# Altium schematic sheet FPGA_0.SchDoc
size A1; SheetNumber: 8; SheetTotal: 14
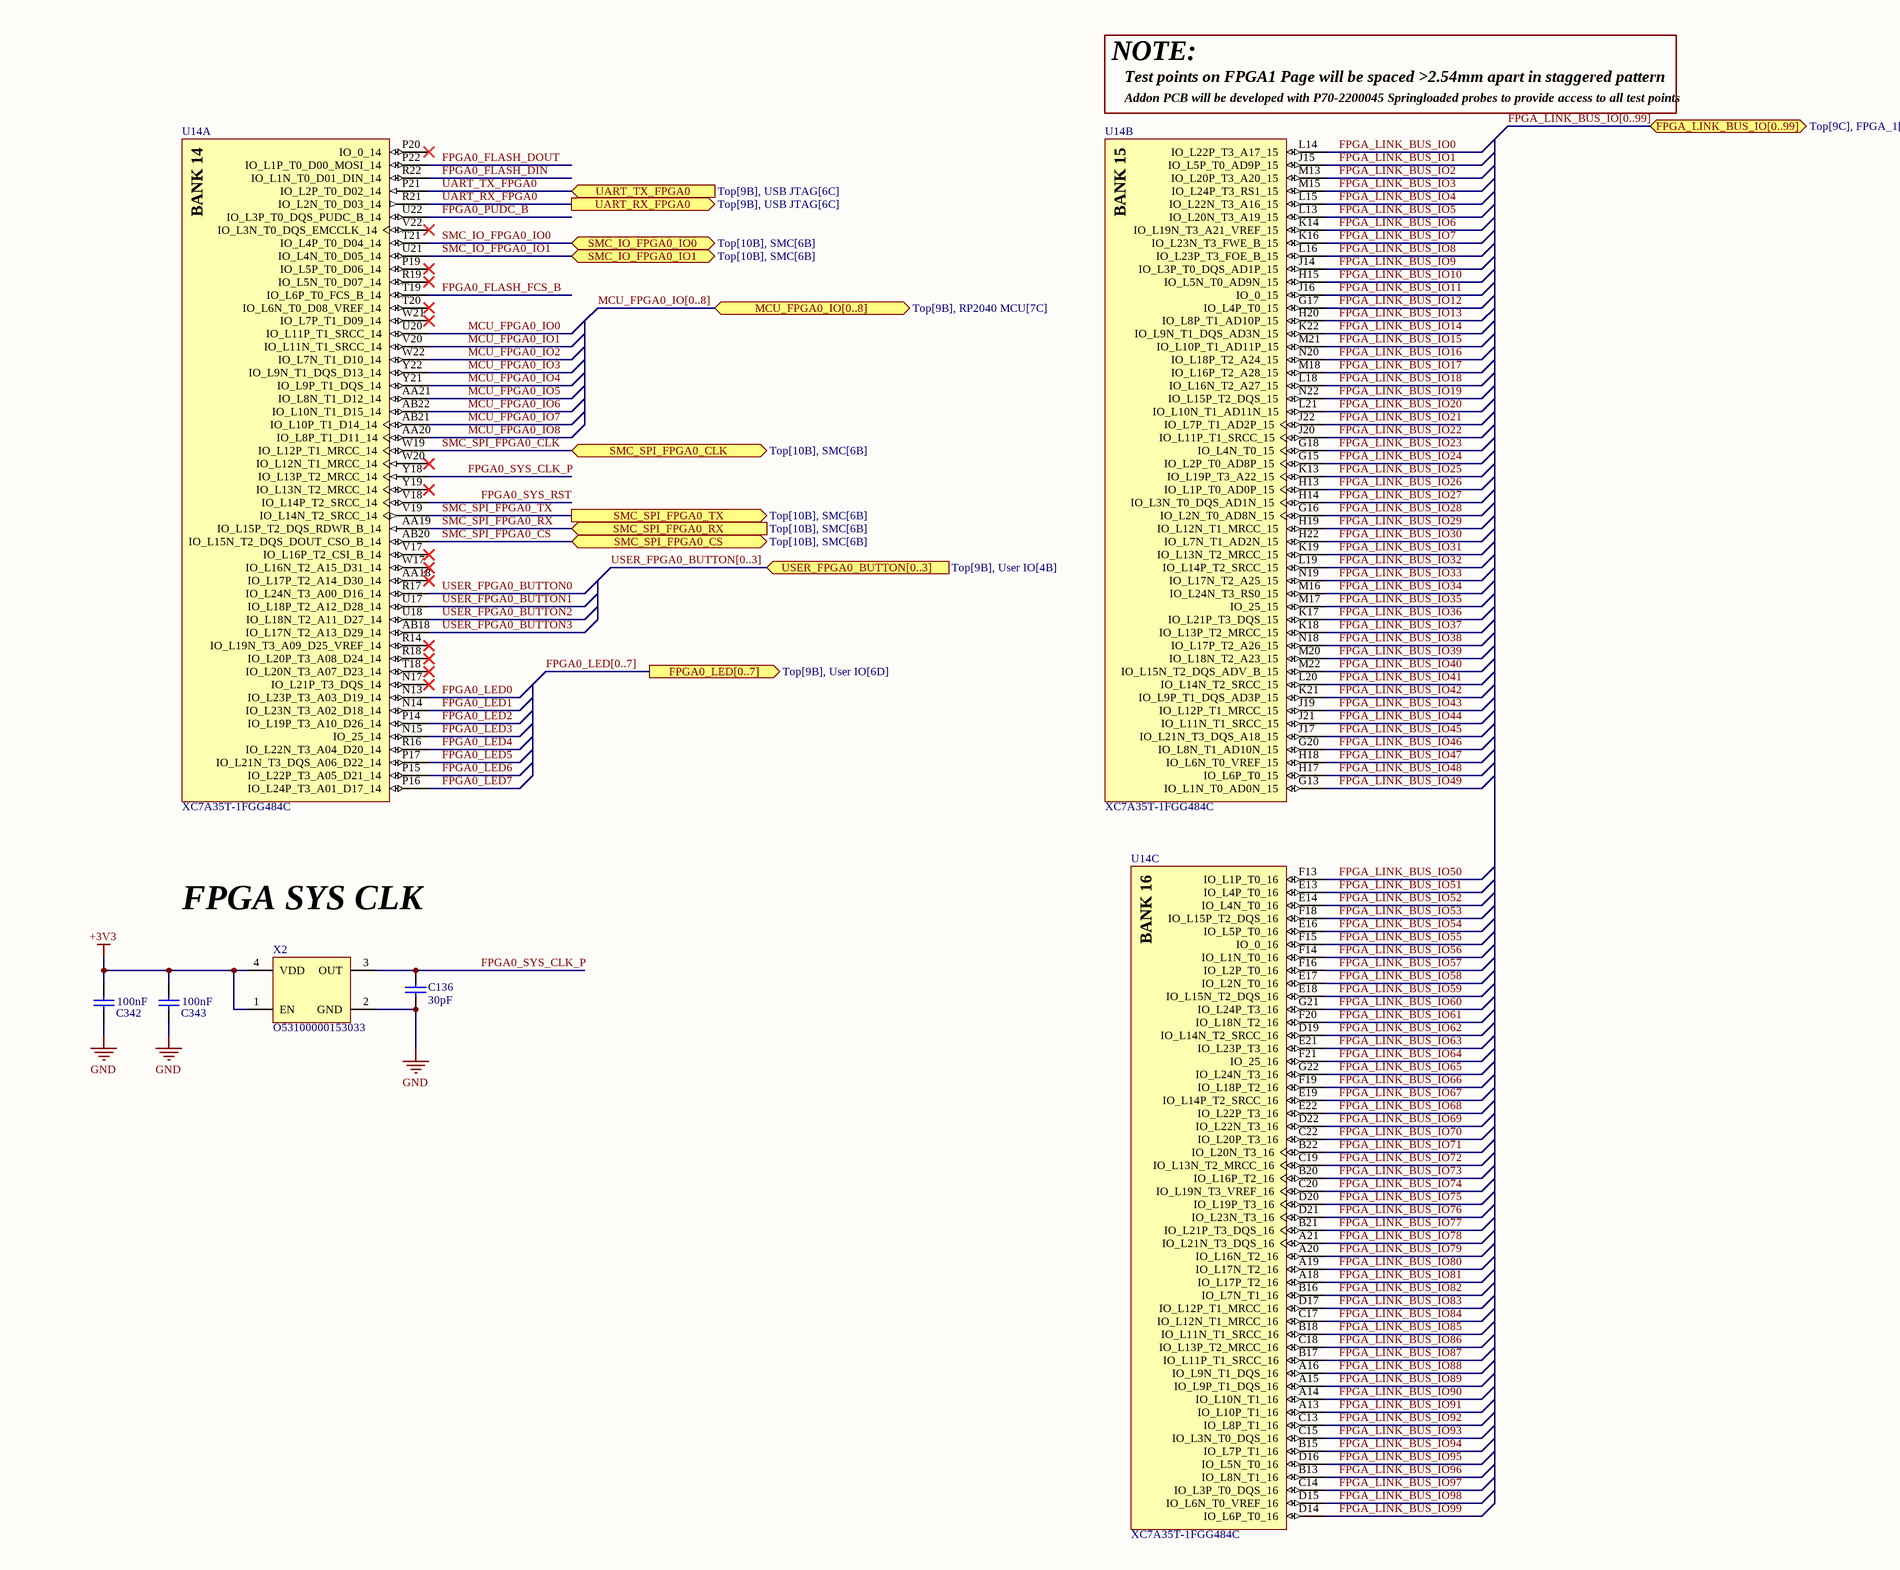
[diagram p0: FPGA_0.SchDoc, top left]
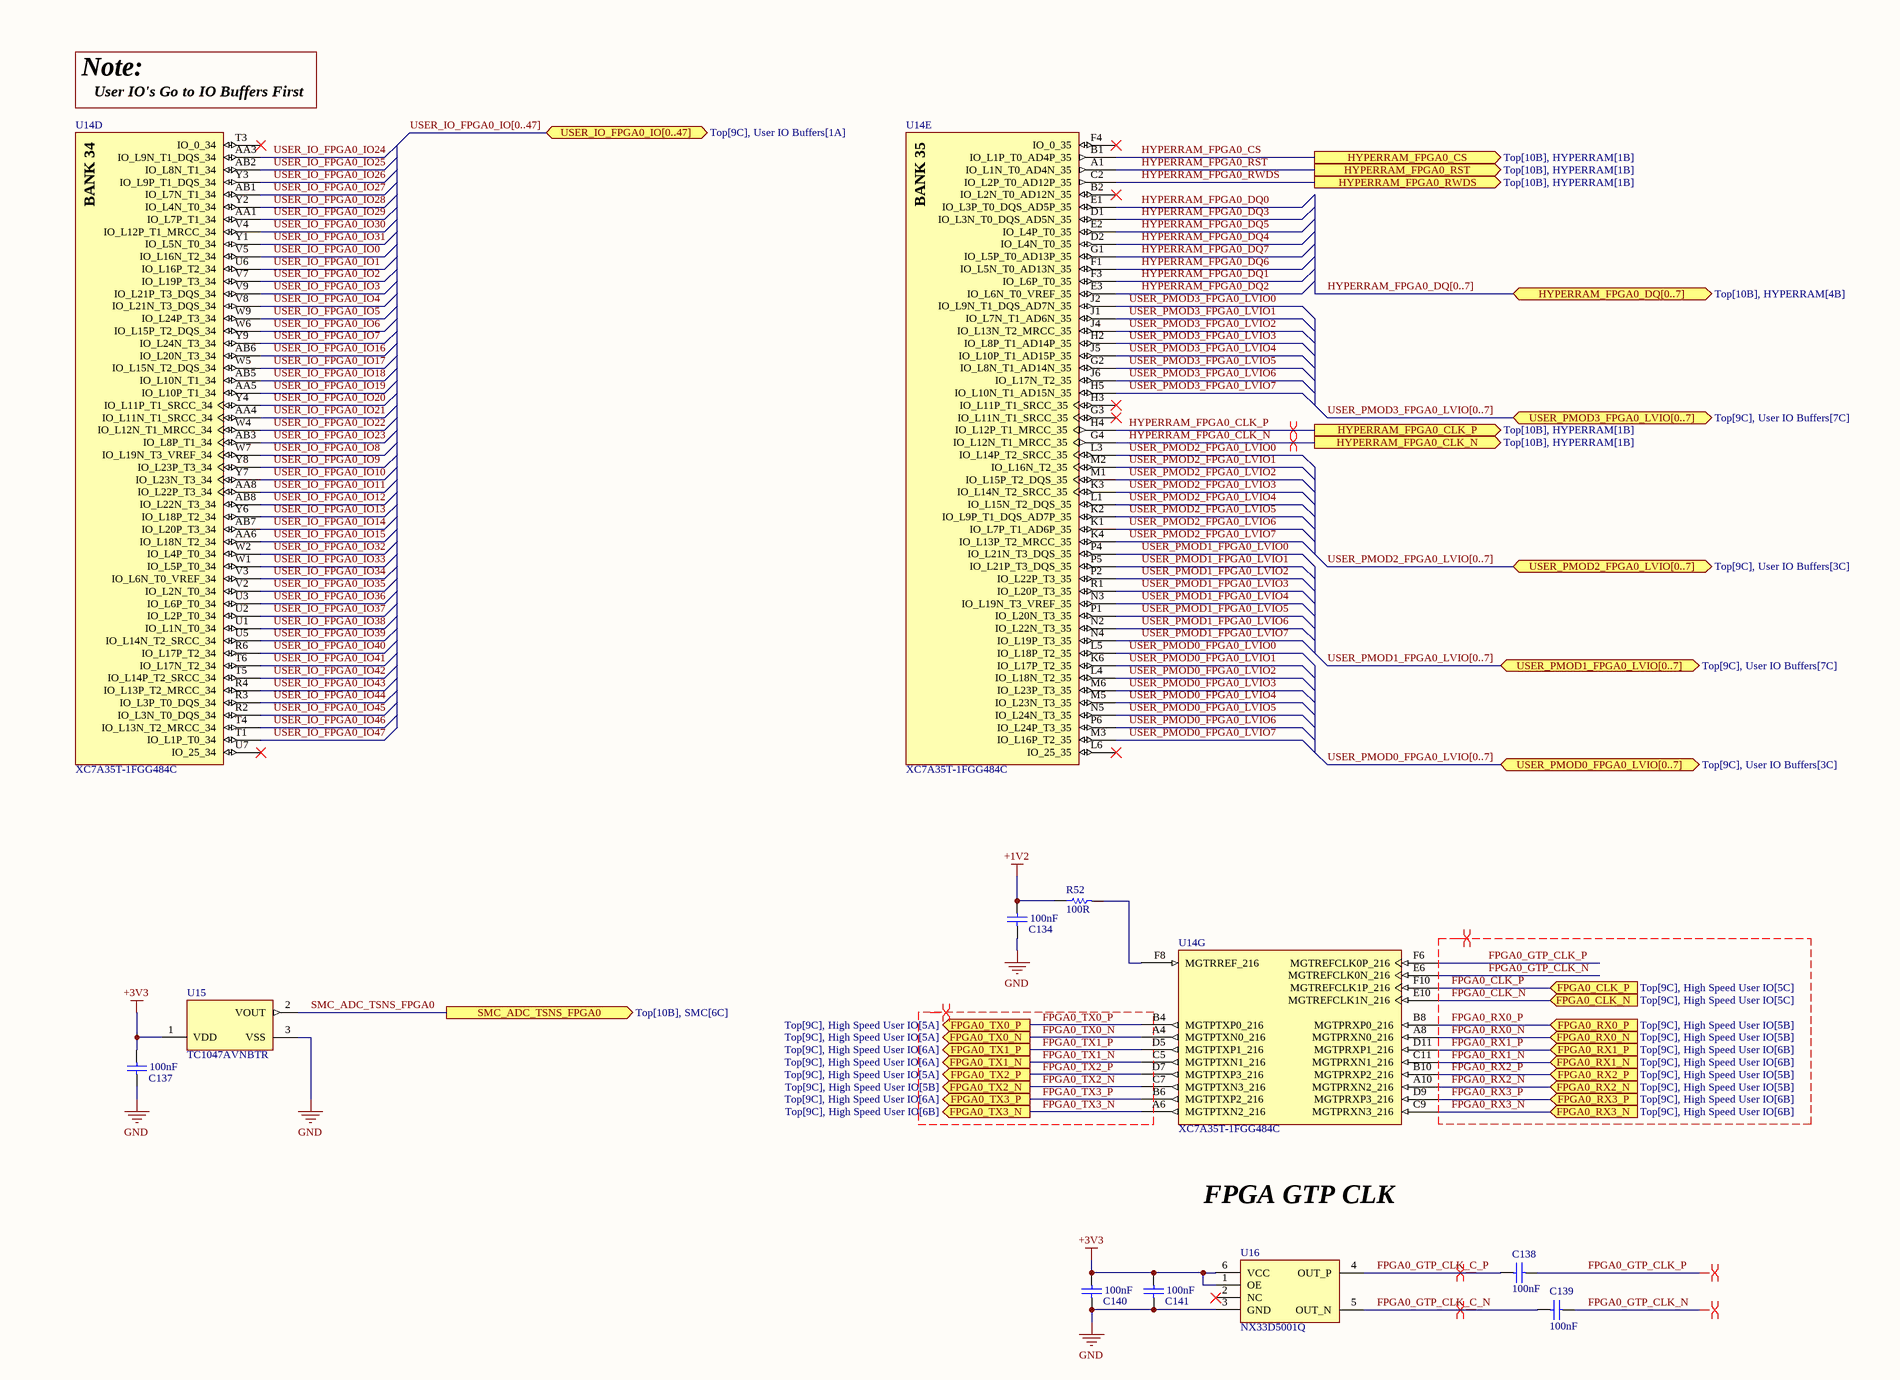
[diagram p1: FPGA_0.SchDoc, top right]
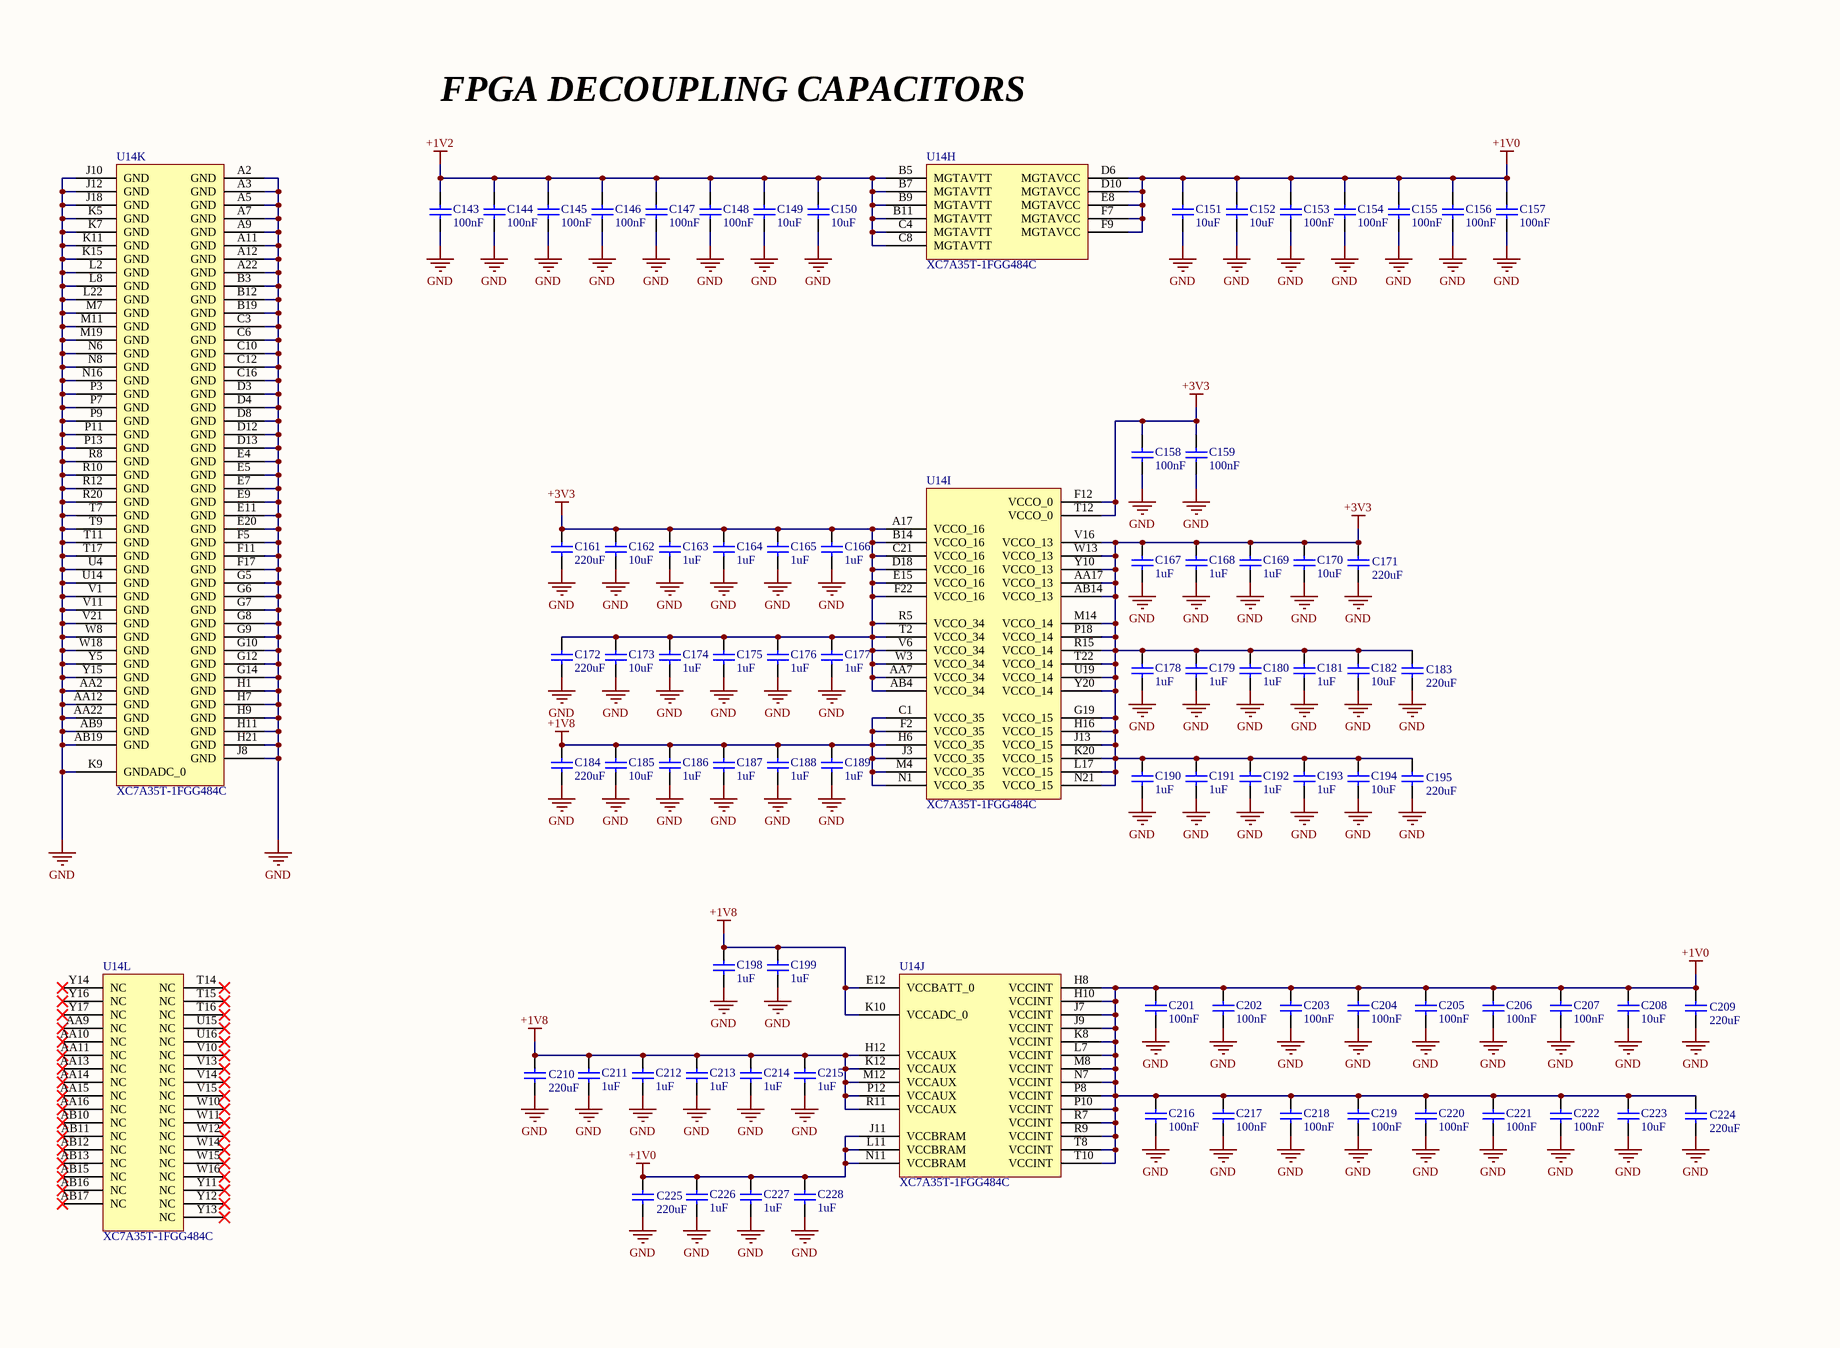
[diagram p2: FPGA_0.SchDoc, bottom left]
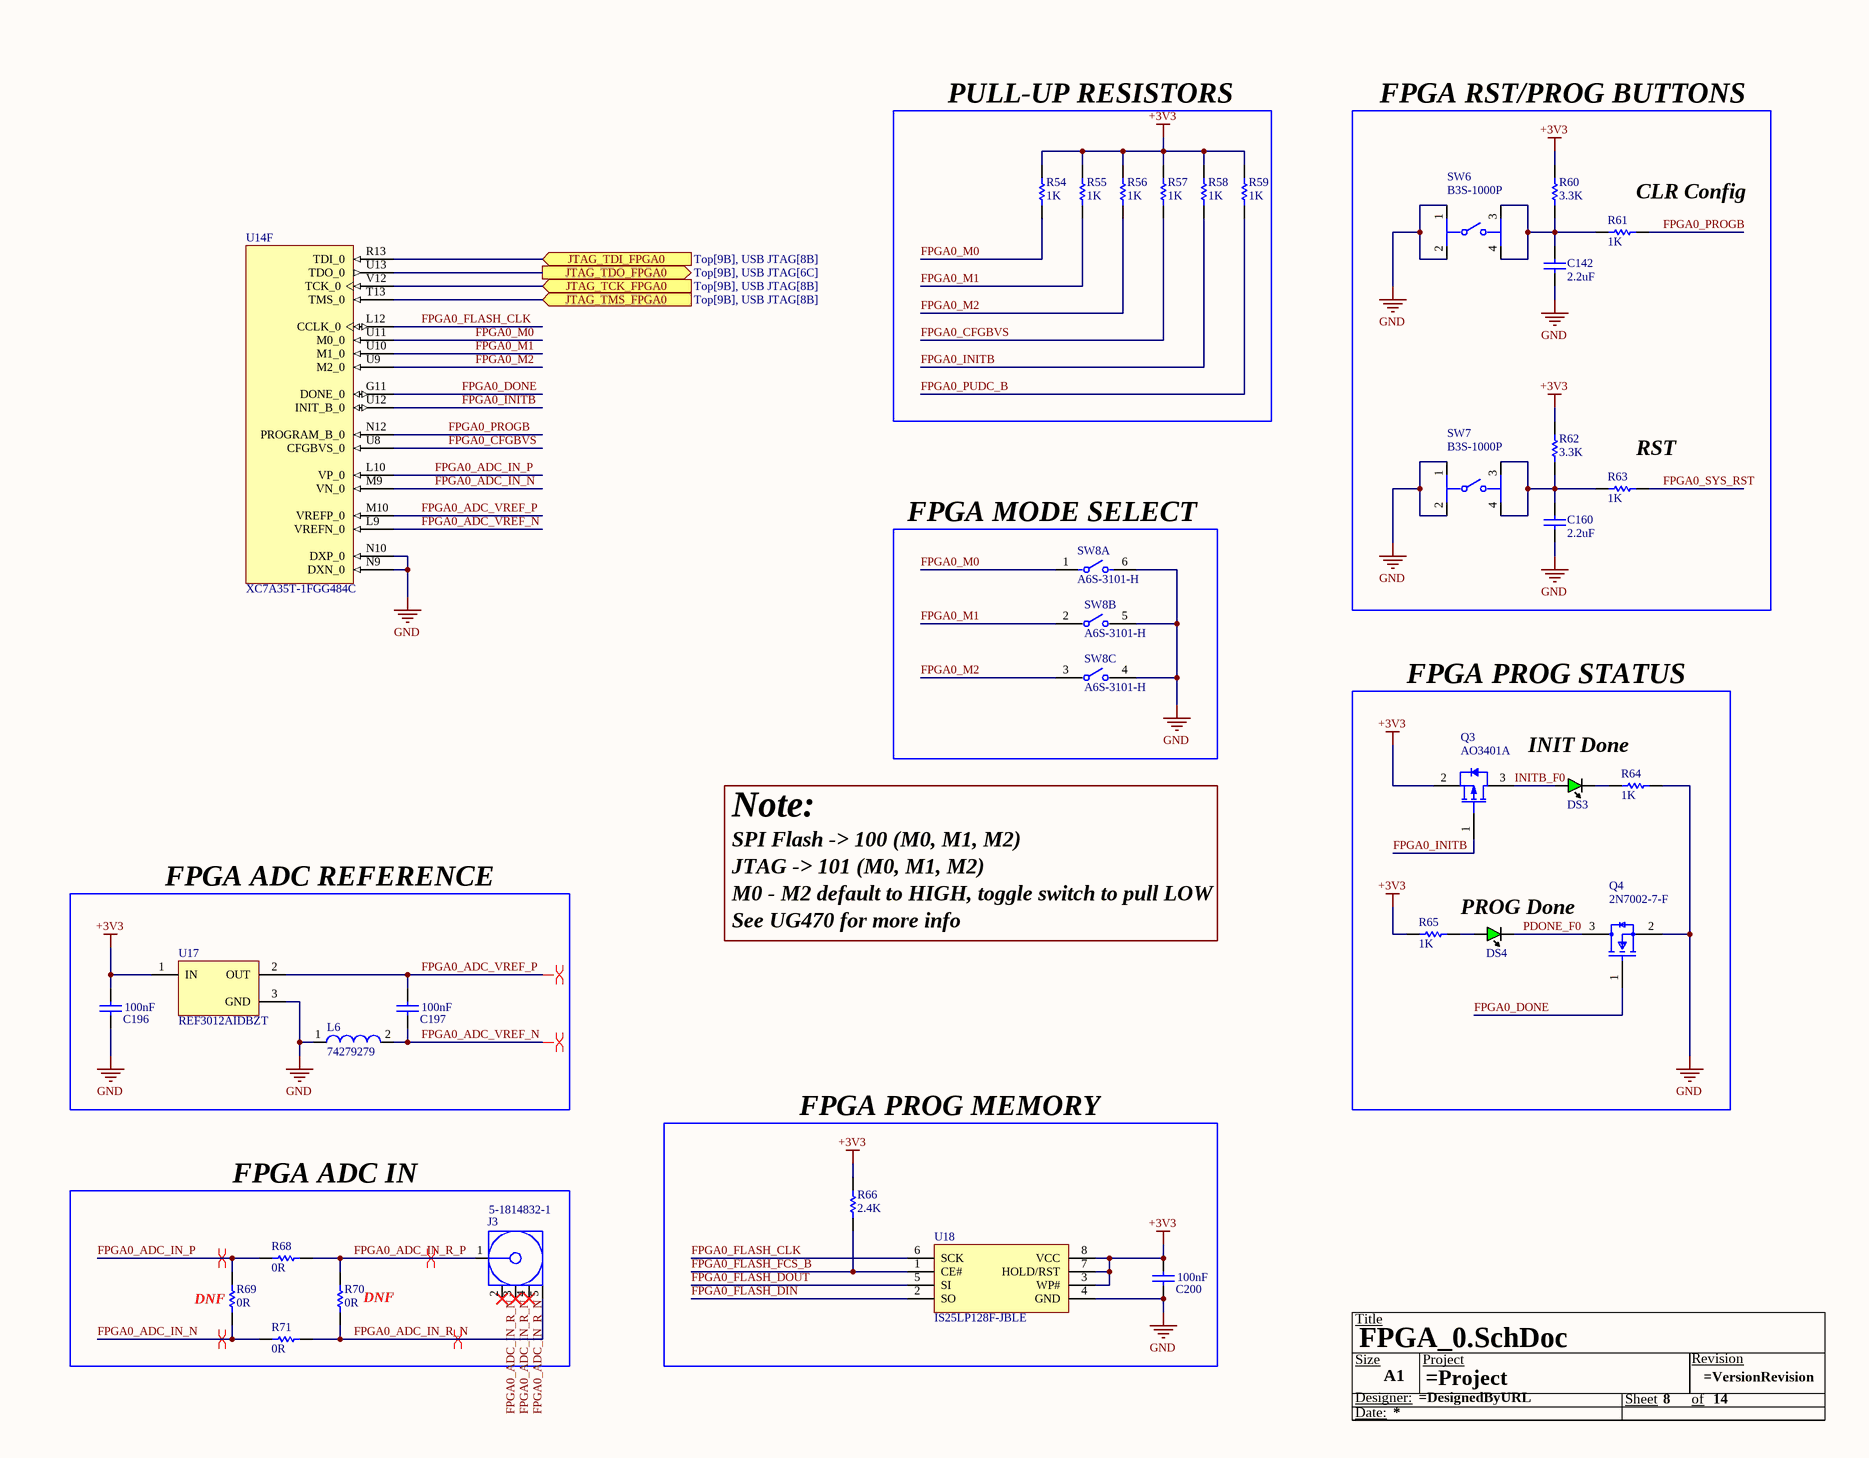
[diagram p3: FPGA_0.SchDoc, bottom right]

## Parts
*  Size: A1  (hidden comment: Title Block)  (graphical)
C134  100nF  [CAPC1005X05N]
C136  30pF  [CAPC1005X56X25NL10T15]
C137  100nF  [CAPC1005X05N]
C138  100nF  [CAPC1005X05N]
C139  100nF  [CAPC1005X05N]
C140  100nF  [CAPC1005X05N]
C141  100nF  [CAPC1005X05N]
C142  2.2uF  [CAPC1005X55X25NL05T10]
C143  value 100nF  [CAPC1005X05N]  (hidden comment: GRM155R71E104KE14J)
C144  value 100nF  [CAPC1005X05N]  (hidden comment: GRM155R71E104KE14J)
C145  value 100nF  [CAPC1005X05N]  (hidden comment: GRM155R71E104KE14J)
C146  value 100nF  [CAPC1005X05N]  (hidden comment: GRM155R71E104KE14J)
C147  value 100nF  [CAPC1005X05N]  (hidden comment: GRM155R71E104KE14J)
C148  value 100nF  [CAPC1005X05N]  (hidden comment: GRM155R71E104KE14J)
C149  value 10uF  [CAPC1608X05N]  (hidden comment: GRM185R60J106ME15J)
C150  value 10uF  [CAPC1608X05N]  (hidden comment: GRM185R60J106ME15J)
C151  value 10uF  [CAPC1608X05N]  (hidden comment: GRM185R60J106ME15J)
C152  value 10uF  [CAPC1608X05N]  (hidden comment: GRM185R60J106ME15J)
C153  value 100nF  [CAPC1005X05N]  (hidden comment: GRM155R71E104KE14J)
C154  value 100nF  [CAPC1005X05N]  (hidden comment: GRM155R71E104KE14J)
C155  value 100nF  [CAPC1005X05N]  (hidden comment: GRM155R71E104KE14J)
C156  value 100nF  [CAPC1005X05N]  (hidden comment: GRM155R71E104KE14J)
C157  value 100nF  [CAPC1005X05N]  (hidden comment: GRM155R71E104KE14J)
C158  value 100nF  [CAPC1005X05N]  (hidden comment: GRM155R71E104KE14J)
C159  value 100nF  [CAPC1005X05N]  (hidden comment: GRM155R71E104KE14J)
C160  2.2uF  [CAPC1005X55X25NL05T10]
C161  220uF  [CAPC3225X25N]
C162  value 10uF  [CAPC1608X05N]  (hidden comment: GRM185R60J106ME15J)
C163  value 1uF  [CAPC1005X05N]  (hidden comment: GRM153R61A105ME95D)
C164  value 1uF  [CAPC1005X05N]  (hidden comment: GRM153R61A105ME95D)
C165  value 1uF  [CAPC1005X05N]  (hidden comment: GRM153R61A105ME95D)
C166  value 1uF  [CAPC1005X05N]  (hidden comment: GRM153R61A105ME95D)
C167  value 1uF  [CAPC1005X05N]  (hidden comment: GRM153R61A105ME95D)
C168  value 1uF  [CAPC1005X05N]  (hidden comment: GRM153R61A105ME95D)
C169  value 1uF  [CAPC1005X05N]  (hidden comment: GRM153R61A105ME95D)
C170  value 10uF  [CAPC1608X05N]  (hidden comment: GRM185R60J106ME15J)
C171  220uF  [CAPC3225X25N]
C172  220uF  [CAPC3225X25N]
C173  value 10uF  [CAPC1608X05N]  (hidden comment: GRM185R60J106ME15J)
C174  value 1uF  [CAPC1005X05N]  (hidden comment: GRM153R61A105ME95D)
C175  value 1uF  [CAPC1005X05N]  (hidden comment: GRM153R61A105ME95D)
C176  value 1uF  [CAPC1005X05N]  (hidden comment: GRM153R61A105ME95D)
C177  value 1uF  [CAPC1005X05N]  (hidden comment: GRM153R61A105ME95D)
C178  value 1uF  [CAPC1005X05N]  (hidden comment: GRM153R61A105ME95D)
C179  value 1uF  [CAPC1005X05N]  (hidden comment: GRM153R61A105ME95D)
C180  value 1uF  [CAPC1005X05N]  (hidden comment: GRM153R61A105ME95D)
C181  value 1uF  [CAPC1005X05N]  (hidden comment: GRM153R61A105ME95D)
C182  value 10uF  [CAPC1608X05N]  (hidden comment: GRM185R60J106ME15J)
C183  220uF  [CAPC3225X25N]
C184  220uF  [CAPC3225X25N]
C185  value 10uF  [CAPC1608X05N]  (hidden comment: GRM185R60J106ME15J)
C186  value 1uF  [CAPC1005X05N]  (hidden comment: GRM153R61A105ME95D)
C187  value 1uF  [CAPC1005X05N]  (hidden comment: GRM153R61A105ME95D)
C188  value 1uF  [CAPC1005X05N]  (hidden comment: GRM153R61A105ME95D)
C189  value 1uF  [CAPC1005X05N]  (hidden comment: GRM153R61A105ME95D)
C190  value 1uF  [CAPC1005X05N]  (hidden comment: GRM153R61A105ME95D)
C191  value 1uF  [CAPC1005X05N]  (hidden comment: GRM153R61A105ME95D)
C192  value 1uF  [CAPC1005X05N]  (hidden comment: GRM153R61A105ME95D)
C193  value 1uF  [CAPC1005X05N]  (hidden comment: GRM153R61A105ME95D)
C194  value 10uF  [CAPC1608X05N]  (hidden comment: GRM185R60J106ME15J)
C195  220uF  [CAPC3225X25N]
C196  100nF  [CAPC1005X05N]
C197  100nF  [CAPC1005X05N]
C198  value 1uF  [CAPC1005X05N]  (hidden comment: GRM153R61A105ME95D)
C199  value 1uF  [CAPC1005X05N]  (hidden comment: GRM153R61A105ME95D)
C200  100nF  [CAPC1005X05N]
C201  value 100nF  [CAPC1005X05N]  (hidden comment: GRM155R71E104KE14J)
C202  value 100nF  [CAPC1005X05N]  (hidden comment: GRM155R71E104KE14J)
C203  value 100nF  [CAPC1005X05N]  (hidden comment: GRM155R71E104KE14J)
C204  value 100nF  [CAPC1005X05N]  (hidden comment: GRM155R71E104KE14J)
C205  value 100nF  [CAPC1005X05N]  (hidden comment: GRM155R71E104KE14J)
C206  value 100nF  [CAPC1005X05N]  (hidden comment: GRM155R71E104KE14J)
C207  value 100nF  [CAPC1005X05N]  (hidden comment: GRM155R71E104KE14J)
C208  value 10uF  [CAPC1608X05N]  (hidden comment: GRM185R60J106ME15J)
C209  220uF  [CAPC3225X25N]
C210  220uF  [CAPC3225X25N]
C211  value 1uF  [CAPC1005X05N]  (hidden comment: GRM153R61A105ME95D)
C212  value 1uF  [CAPC1005X05N]  (hidden comment: GRM153R61A105ME95D)
C213  value 1uF  [CAPC1005X05N]  (hidden comment: GRM153R61A105ME95D)
C214  value 1uF  [CAPC1005X05N]  (hidden comment: GRM153R61A105ME95D)
C215  value 1uF  [CAPC1005X05N]  (hidden comment: GRM153R61A105ME95D)
C216  value 100nF  [CAPC1005X05N]  (hidden comment: GRM155R71E104KE14J)
C217  value 100nF  [CAPC1005X05N]  (hidden comment: GRM155R71E104KE14J)
C218  value 100nF  [CAPC1005X05N]  (hidden comment: GRM155R71E104KE14J)
C219  value 100nF  [CAPC1005X05N]  (hidden comment: GRM155R71E104KE14J)
C220  value 100nF  [CAPC1005X05N]  (hidden comment: GRM155R71E104KE14J)
C221  value 100nF  [CAPC1005X05N]  (hidden comment: GRM155R71E104KE14J)
C222  value 100nF  [CAPC1005X05N]  (hidden comment: GRM155R71E104KE14J)
C223  value 10uF  [CAPC1608X05N]  (hidden comment: GRM185R60J106ME15J)
C224  220uF  [CAPC3225X25N]
C225  220uF  [CAPC3225X25N]
C226  value 1uF  [CAPC1005X05N]  (hidden comment: GRM153R61A105ME95D)
C227  value 1uF  [CAPC1005X05N]  (hidden comment: GRM153R61A105ME95D)
C228  value 1uF  [CAPC1005X05N]  (hidden comment: GRM153R61A105ME95D)
C342  100nF  [CAPC1005X05N]
C343  100nF  [CAPC1005X05N]
DS3  SMLLX0603GWTR  [LUMX-SML-LX0603_V]  (value not drawn)
DS4  SMLLX0603GWTR  [LUMX-SML-LX0603_V]  (value not drawn)
J3  5-1814832-1  [TECO-5-1814832-1_V]
L6  74279279  [SMD-0402]
Q3  AO3401A  [AO-SOT-23-3L_V]
Q4  2N7002-7-F  [FP-SOT23-MFG]
R52  100R  [RESC1005X40X25NL05T05]
R54  1K  [RESC1005X40X25NL05T10]
R55  1K  [RESC1005X40X25NL05T10]
R56  1K  [RESC1005X40X25NL05T10]
R57  1K  [RESC1005X40X25NL05T10]
R58  1K  [RESC1005X40X25NL05T10]
R59  1K  [RESC1005X40X25NL05T10]
R60  3.3K  [RESC1005X40X25NL05T10]
R61  1K  [RESC1005X40X25NL05T10]
R62  3.3K  [RESC1005X40X25NL05T10]
R63  1K  [RESC1005X40X25NL05T10]
R64  1K  [RESC1005X40X25NL05T10]
R65  1K  [RESC1005X40X25NL05T10]
R66  2.4K  [RESC1005X40X25NL05T05]
R68  0R  [RESC1005X40X25NL05T10]
R69  0R  [RESC1005X40X25NL05T10]
R70  0R  [RESC1005X40X25NL05T10]
R71  0R  [RESC1005X40X25NL05T10]
SW6  B3S-1000P  [FP-B3S-1000P-MFG]
SW7  B3S-1000P  [FP-B3S-1000P-MFG]
SW8  A6S-3101-H  [FP-A6S-3101-H-MFG]  (parts A,B,C of 3)
U14  XC7A35T-1FGG484C  [FGG484]  (parts A,B,C,D,E,F,G,H,I,J,K,L of 12)
U15  TC1047AVNBTR  [SOT-23-NB3_L]
U16  NX33D5001Q  [SOTFL125P185X90-6N]
U17  REF3012AIDBZT  [DBZ0003A_L]
U18  IS25LP128F-JBLE  [SOIC127P790X216-8N]
X2  O53100000153033  [DFN254P500X120-4N]

## Blocks framed on the sheet
PULL-UP RESISTORS: R54-R59
FPGA RST/PROG BUTTONS: C142 C160 R60-R63 SW6 SW7
FPGA MODE SELECT: SW8
FPGA PROG STATUS: DS3 DS4 Q3 Q4 R64 R65
FPGA ADC REFERENCE: C196 C197 L6 U17
FPGA PROG MEMORY: C200 R66 U18

## Ports
FPGA0_CLK_N (in, see Top[9C], High Speed User IO[5C]), FPGA0_CLK_P (in, see Top[9C], High Speed User IO[5C]), FPGA0_LED[0..7] (out, see Top[9B], User IO[6D]), FPGA0_RX0_N (in, see Top[9C], High Speed User IO[5B]), FPGA0_RX0_P (in, see Top[9C], High Speed User IO[5B]), FPGA0_RX1_N (in, see Top[9C], High Speed User IO[6B]), FPGA0_RX1_P (in, see Top[9C], High Speed User IO[6B]), FPGA0_RX2_N (in, see Top[9C], High Speed User IO[5B]), FPGA0_RX2_P (in, see Top[9C], High Speed User IO[5B]), FPGA0_RX3_N (in, see Top[9C], High Speed User IO[6B]), FPGA0_RX3_P (in, see Top[9C], High Speed User IO[6B]), FPGA0_TX0_N (out, see Top[9C], High Speed User IO[5A]), FPGA0_TX0_P (out, see Top[9C], High Speed User IO[5A]), FPGA0_TX1_N (out, see Top[9C], High Speed User IO[6A]), FPGA0_TX1_P (out, see Top[9C], High Speed User IO[6A]), FPGA0_TX2_N (out, see Top[9C], High Speed User IO[5B]), FPGA0_TX2_P (out, see Top[9C], High Speed User IO[5A]), FPGA0_TX3_N (out, see Top[9C], High Speed User IO[6B]), FPGA0_TX3_P (out, see Top[9C], High Speed User IO[6A]), FPGA_LINK_BUS_IO[0..99] (bidir, see Top[9C], FPGA_1[6A]), HYPERRAM_FPGA0_CLK_N (out, see Top[10B], HYPERRAM[1B]), HYPERRAM_FPGA0_CLK_P (out, see Top[10B], HYPERRAM[1B]), HYPERRAM_FPGA0_CS (out, see Top[10B], HYPERRAM[1B]), HYPERRAM_FPGA0_DQ[0..7] (bidir, see Top[10B], HYPERRAM[4B]), HYPERRAM_FPGA0_RST (out, see Top[10B], HYPERRAM[1B]), HYPERRAM_FPGA0_RWDS (out, see Top[10B], HYPERRAM[1B]), JTAG_TCK_FPGA0 (in, see Top[9B], USB JTAG[8B]), JTAG_TDI_FPGA0 (in, see Top[9B], USB JTAG[8B]), JTAG_TDO_FPGA0 (out, see Top[9B], USB JTAG[6C]), JTAG_TMS_FPGA0 (in, see Top[9B], USB JTAG[8B]), MCU_FPGA0_IO[0..8] (bidir, see Top[9B], RP2040 MCU[7C]), SMC_ADC_TSNS_FPGA0 (out, see Top[10B], SMC[6C]), SMC_IO_FPGA0_IO0 (bidir, see Top[10B], SMC[6B]), SMC_IO_FPGA0_IO1 (bidir, see Top[10B], SMC[6B]), SMC_SPI_FPGA0_CLK (bidir, see Top[10B], SMC[6B]), SMC_SPI_FPGA0_CS (bidir, see Top[10B], SMC[6B]), SMC_SPI_FPGA0_RX (in, see Top[10B], SMC[6B]), SMC_SPI_FPGA0_TX (out, see Top[10B], SMC[6B]), UART_RX_FPGA0 (out, see Top[9B], USB JTAG[6C]), UART_TX_FPGA0 (in, see Top[9B], USB JTAG[6C]), USER_FPGA0_BUTTON[0..3] (in, see Top[9B], User IO[4B]), USER_IO_FPGA0_IO[0..47] (bidir, see Top[9C], User IO Buffers[1A]), USER_PMOD0_FPGA0_LVIO[0..7] (bidir, see Top[9C], User IO Buffers[3C]), USER_PMOD1_FPGA0_LVIO[0..7] (bidir, see Top[9C], User IO Buffers[7C]), USER_PMOD2_FPGA0_LVIO[0..7] (bidir, see Top[9C], User IO Buffers[3C]), USER_PMOD3_FPGA0_LVIO[0..7] (bidir, see Top[9C], User IO Buffers[7C])

## Nets
+1V0: C151.2 C152.2 C153.2 C154.2 C155.2 C156.2 C157.2 C201.2 C202.2 C203.2 C204.2 C205.2 C206.2 C207.2 C208.2 C209.2 C216.2 C217.2 C218.2 C219.2 C220.2 C221.2 C222.2 C223.2 C224.2 C225.2 C226.2 C227.2 C228.2 U14.D6(MGTAVCC) U14.D10(MGTAVCC) U14.E8(MGTAVCC) U14.F7(MGTAVCC) U14.F9(MGTAVCC) U14.H8(VCCINT) U14.H10(VCCINT) U14.J7(VCCINT) U14.J9(VCCINT) U14.J11(VCCBRAM) U14.K8(VCCINT) U14.L7(VCCINT) U14.L11(VCCBRAM) U14.M8(VCCINT) U14.N7(VCCINT) U14.N11(VCCBRAM) U14.P8(VCCINT) U14.P10(VCCINT) U14.R7(VCCINT) U14.R9(VCCINT) U14.T8(VCCINT) U14.T10(VCCINT)
+1V2: C134.2 C143.2 C144.2 C145.2 C146.2 C147.2 C148.2 C149.2 C150.2 R52.1 U14.B5(MGTAVTT) U14.B7(MGTAVTT) U14.B9(MGTAVTT) U14.B11(MGTAVTT) U14.C4(MGTAVTT) U14.C8(MGTAVTT)
+1V8: C184.2 C185.2 C186.2 C187.2 C188.2 C189.2 C198.2 C199.2 C210.2 C211.2 C212.2 C213.2 C214.2 C215.2 U14.C1(VCCO_35) U14.E12(VCCBATT_0) U14.F2(VCCO_35) U14.H6(VCCO_35) U14.H12(VCCAUX) U14.J3(VCCO_35) U14.K10(VCCADC_0) U14.K12(VCCAUX) U14.M4(VCCO_35) U14.M12(VCCAUX) U14.N1(VCCO_35) U14.P12(VCCAUX) U14.R11(VCCAUX)
+3V3: C137.2 C140.2 C141.2 C158.2 C159.2 C161.2 C162.2 C163.2 C164.2 C165.2 C166.2 C167.2 C168.2 C169.2 C170.2 C171.2 C172.2 C173.2 C174.2 C175.2 C176.2 C177.2 C178.2 C179.2 C180.2 C181.2 C182.2 C183.2 C190.2 C191.2 C192.2 C193.2 C194.2 C195.2 C196.2 C200.2 C342.2 C343.2 Q3.2(SOURCE) R54.2 R55.2 R56.2 R57.2 R58.2 R59.2 R60.2 R62.2 R65.2 R66.2 U14.A17(VCCO_16) U14.AA7(VCCO_34) U14.AA17(VCCO_13) U14.AB4(VCCO_34) U14.AB14(VCCO_13) U14.B14(VCCO_16) U14.C21(VCCO_16) U14.D18(VCCO_16) U14.E15(VCCO_16) U14.F12(VCCO_0) U14.F22(VCCO_16) U14.G19(VCCO_15) U14.H16(VCCO_15) U14.J13(VCCO_15) U14.K20(VCCO_15) U14.L17(VCCO_15) U14.M14(VCCO_14) U14.N21(VCCO_15) U14.P18(VCCO_14) U14.R5(VCCO_34) U14.R15(VCCO_14) U14.T2(VCCO_34) U14.T12(VCCO_0) U14.T22(VCCO_14) U14.U19(VCCO_14) U14.V6(VCCO_34) U14.V16(VCCO_13) U14.W3(VCCO_34) U14.W13(VCCO_13) U14.Y10(VCCO_13) U14.Y20(VCCO_14) U15.1(VDD) U16.1(OE) U16.6(VCC) U17.1(IN) U18.3(WP#) U18.7(HOLD/RST) U18.8(VCC) X2.1(EN) X2.4(VDD)
GND: C134.1 C136.1 C137.1 C140.1 C141.1 C142.1 C143.1 C144.1 C145.1 C146.1 C147.1 C148.1 C149.1 C150.1 C151.1 C152.1 C153.1 C154.1 C155.1 C156.1 C157.1 C158.1 C159.1 C160.1 C161.1 C162.1 C163.1 C164.1 C165.1 C166.1 C167.1 C168.1 C169.1 C170.1 C171.1 C172.1 C173.1 C174.1 C175.1 C176.1 C177.1 C178.1 C179.1 C180.1 C181.1 C182.1 C183.1 C184.1 C185.1 C186.1 C187.1 C188.1 C189.1 C190.1 C191.1 C192.1 C193.1 C194.1 C195.1 C196.1 C198.1 C199.1 C200.1 C201.1 C202.1 C203.1 C204.1 C205.1 C206.1 C207.1 C208.1 C209.1 C210.1 C211.1 C212.1 C213.1 C214.1 C215.1 C216.1 C217.1 C218.1 C219.1 C220.1 C221.1 C222.1 C223.1 C224.1 C225.1 C226.1 C227.1 C228.1 C342.1 C343.1 L6.1 Q4.2(S) R64.1 SW6.1 SW6.2 SW7.1 SW7.2 SW8.4 SW8.5 SW8.6 U14.A2(GND) U14.A3(GND) U14.A5(GND) U14.A7(GND) U14.A9(GND) U14.A11(GND) U14.A12(GND) U14.A22(GND) U14.AA2(GND) U14.AA12(GND) U14.AA22(GND) U14.AB9(GND) U14.AB19(GND) U14.B3(GND) U14.B12(GND) U14.B19(GND) U14.C3(GND) U14.C6(GND) U14.C10(GND) U14.C12(GND) U14.C16(GND) U14.D3(GND) U14.D4(GND) U14.D8(GND) U14.D12(GND) U14.D13(GND) U14.E4(GND) U14.E5(GND) U14.E7(GND) U14.E9(GND) U14.E11(GND) U14.E20(GND) U14.F5(GND) U14.F11(GND) U14.F17(GND) U14.G5(GND) U14.G6(GND) U14.G7(GND) U14.G8(GND) U14.G9(GND) U14.G10(GND) U14.G12(GND) U14.G14(GND) U14.H1(GND) U14.H7(GND) U14.H9(GND) U14.H11(GND) U14.H21(GND) U14.J8(GND) U14.J10(GND) U14.J12(GND) U14.J18(GND) U14.K5(GND) U14.K7(GND) U14.K9(GNDADC_0) U14.K11(GND) U14.K15(GND) U14.L2(GND) U14.L8(GND) U14.L22(GND) U14.M7(GND) U14.M11(GND) U14.M19(GND) U14.N6(GND) U14.N8(GND) U14.N9(DXN_0) U14.N10(DXP_0) U14.N16(GND) U14.P3(GND) U14.P7(GND) U14.P9(GND) U14.P11(GND) U14.P13(GND) U14.R8(GND) U14.R10(GND) U14.R12(GND) U14.R20(GND) U14.T7(GND) U14.T9(GND) U14.T11(GND) U14.T17(GND) U14.U4(GND) U14.U14(GND) U14.V1(GND) U14.V11(GND) U14.V21(GND) U14.W8(GND) U14.W18(GND) U14.Y5(GND) U14.Y15(GND) U15.3(VSS) U16.3(GND) U17.3(GND) U18.4(GND) X2.2(GND)
FPGA0_ADC_IN_N: R69.1 R71.1 U14.M9(VN_0)
FPGA0_ADC_IN_P: R68.1 R69.2 U14.L10(VP_0)
FPGA0_ADC_IN_R_N: J3.2 J3.3 J3.4 J3.5 R70.1 R71.2
FPGA0_ADC_IN_R_P: J3.1 R68.2 R70.2
FPGA0_ADC_VREF_N: C197.1 L6.2 U14.L9(VREFN_0)
FPGA0_ADC_VREF_P: C197.2 U14.M10(VREFP_0) U17.2(OUT)
FPGA0_CFGBVS: R57.1 U14.U8(CFGBVS_0)
FPGA0_CLK_N: U14.E10(MGTREFCLK1N_216) ; port FPGA0_CLK_N
FPGA0_CLK_P: U14.F10(MGTREFCLK1P_216) ; port FPGA0_CLK_P
FPGA0_DONE: Q4.1(G) U14.G11(DONE_0)
FPGA0_FLASH_CLK: U14.L12(CCLK_0) U18.6(SCK)
FPGA0_FLASH_DIN: U14.R22(IO_L1N_T0_D01_DIN_14) U18.2(SO)
FPGA0_FLASH_DOUT: U14.P22(IO_L1P_T0_D00_MOSI_14) U18.5(SI)
FPGA0_FLASH_FCS_B: R66.1 U14.T19(IO_L6P_T0_FCS_B_14) U18.1(CE#)
FPGA0_GTP_CLK_C_N: C139.2 U16.5(OUT_N)
FPGA0_GTP_CLK_C_P: C138.2 U16.4(OUT_P)
FPGA0_GTP_CLK_N: C139.1 U14.E6(MGTREFCLK0N_216)
FPGA0_GTP_CLK_P: C138.1 U14.F6(MGTREFCLK0P_216)
FPGA0_INITB: Q3.1(GATE) R58.1 U14.U12(INIT_B_0)
FPGA0_LED0: U14.N13(IO_L23P_T3_A03_D19_14)
FPGA0_LED1: U14.N14(IO_L23N_T3_A02_D18_14)
FPGA0_LED2: U14.P14(IO_L19P_T3_A10_D26_14)
FPGA0_LED3: U14.N15(IO_25_14)
FPGA0_LED4: U14.R16(IO_L22N_T3_A04_D20_14)
FPGA0_LED5: U14.P17(IO_L21N_T3_DQS_A06_D22_14)
FPGA0_LED6: U14.P15(IO_L22P_T3_A05_D21_14)
FPGA0_LED7: U14.P16(IO_L24P_T3_A01_D17_14)
FPGA0_M0: R54.1 SW8.1 U14.U11(M0_0)
FPGA0_M1: R55.1 SW8.2 U14.U10(M1_0)
FPGA0_M2: R56.1 SW8.3 U14.U9(M2_0)
FPGA0_PROGB: R61.1 U14.N12(PROGRAM_B_0)
FPGA0_PUDC_B: R59.1 U14.U22(IO_L3P_T0_DQS_PUDC_B_14)
FPGA0_RX0_N: U14.A8(MGTPRXN0_216) ; port FPGA0_RX0_N
FPGA0_RX0_P: U14.B8(MGTPRXP0_216) ; port FPGA0_RX0_P
FPGA0_RX1_N: U14.C11(MGTPRXN1_216) ; port FPGA0_RX1_N
FPGA0_RX1_P: U14.D11(MGTPRXP1_216) ; port FPGA0_RX1_P
FPGA0_RX2_N: U14.A10(MGTPRXN2_216) ; port FPGA0_RX2_N
FPGA0_RX2_P: U14.B10(MGTPRXP2_216) ; port FPGA0_RX2_P
FPGA0_RX3_N: U14.C9(MGTPRXN3_216) ; port FPGA0_RX3_N
FPGA0_RX3_P: U14.D9(MGTPRXP3_216) ; port FPGA0_RX3_P
FPGA0_SYS_CLK_P: C136.2 U14.Y18(IO_L13P_T2_MRCC_14) X2.3(OUT)
FPGA0_SYS_RST: R63.1 U14.V18(IO_L14P_T2_SRCC_14)
FPGA0_TX0_N: U14.A4(MGTPTXN0_216) ; port FPGA0_TX0_N
FPGA0_TX0_P: U14.B4(MGTPTXP0_216) ; port FPGA0_TX0_P
FPGA0_TX1_N: U14.C5(MGTPTXN1_216) ; port FPGA0_TX1_N
FPGA0_TX1_P: U14.D5(MGTPTXP1_216) ; port FPGA0_TX1_P
FPGA0_TX2_N: U14.C7(MGTPTXN3_216) ; port FPGA0_TX2_N
FPGA0_TX2_P: U14.D7(MGTPTXP3_216) ; port FPGA0_TX2_P
FPGA0_TX3_N: U14.A6(MGTPTXN2_216) ; port FPGA0_TX3_N
FPGA0_TX3_P: U14.B6(MGTPTXP2_216) ; port FPGA0_TX3_P
FPGA_LINK_BUS_IO0: U14.L14(IO_L22P_T3_A17_15)
FPGA_LINK_BUS_IO1: U14.J15(IO_L5P_T0_AD9P_15)
FPGA_LINK_BUS_IO2: U14.M13(IO_L20P_T3_A20_15)
FPGA_LINK_BUS_IO3: U14.M15(IO_L24P_T3_RS1_15)
FPGA_LINK_BUS_IO4: U14.L15(IO_L22N_T3_A16_15)
FPGA_LINK_BUS_IO5: U14.L13(IO_L20N_T3_A19_15)
FPGA_LINK_BUS_IO6: U14.K14(IO_L19N_T3_A21_VREF_15)
FPGA_LINK_BUS_IO7: U14.K16(IO_L23N_T3_FWE_B_15)
FPGA_LINK_BUS_IO8: U14.L16(IO_L23P_T3_FOE_B_15)
FPGA_LINK_BUS_IO9: U14.J14(IO_L3P_T0_DQS_AD1P_15)
FPGA_LINK_BUS_IO10: U14.H15(IO_L5N_T0_AD9N_15)
FPGA_LINK_BUS_IO11: U14.J16(IO_0_15)
FPGA_LINK_BUS_IO12: U14.G17(IO_L4P_T0_15)
FPGA_LINK_BUS_IO13: U14.H20(IO_L8P_T1_AD10P_15)
FPGA_LINK_BUS_IO14: U14.K22(IO_L9N_T1_DQS_AD3N_15)
FPGA_LINK_BUS_IO15: U14.M21(IO_L10P_T1_AD11P_15)
FPGA_LINK_BUS_IO16: U14.N20(IO_L18P_T2_A24_15)
FPGA_LINK_BUS_IO17: U14.M18(IO_L16P_T2_A28_15)
FPGA_LINK_BUS_IO18: U14.L18(IO_L16N_T2_A27_15)
FPGA_LINK_BUS_IO19: U14.N22(IO_L15P_T2_DQS_15)
FPGA_LINK_BUS_IO20: U14.L21(IO_L10N_T1_AD11N_15)
FPGA_LINK_BUS_IO21: U14.J22(IO_L7P_T1_AD2P_15)
FPGA_LINK_BUS_IO22: U14.J20(IO_L11P_T1_SRCC_15)
FPGA_LINK_BUS_IO23: U14.G18(IO_L4N_T0_15)
FPGA_LINK_BUS_IO24: U14.G15(IO_L2P_T0_AD8P_15)
FPGA_LINK_BUS_IO25: U14.K13(IO_L19P_T3_A22_15)
FPGA_LINK_BUS_IO26: U14.H13(IO_L1P_T0_AD0P_15)
FPGA_LINK_BUS_IO27: U14.H14(IO_L3N_T0_DQS_AD1N_15)
FPGA_LINK_BUS_IO28: U14.G16(IO_L2N_T0_AD8N_15)
FPGA_LINK_BUS_IO29: U14.H19(IO_L12N_T1_MRCC_15)
FPGA_LINK_BUS_IO30: U14.H22(IO_L7N_T1_AD2N_15)
FPGA_LINK_BUS_IO31: U14.K19(IO_L13N_T2_MRCC_15)
FPGA_LINK_BUS_IO32: U14.L19(IO_L14P_T2_SRCC_15)
FPGA_LINK_BUS_IO33: U14.N19(IO_L17N_T2_A25_15)
FPGA_LINK_BUS_IO34: U14.M16(IO_L24N_T3_RS0_15)
FPGA_LINK_BUS_IO35: U14.M17(IO_25_15)
FPGA_LINK_BUS_IO36: U14.K17(IO_L21P_T3_DQS_15)
FPGA_LINK_BUS_IO37: U14.K18(IO_L13P_T2_MRCC_15)
FPGA_LINK_BUS_IO38: U14.N18(IO_L17P_T2_A26_15)
FPGA_LINK_BUS_IO39: U14.M20(IO_L18N_T2_A23_15)
FPGA_LINK_BUS_IO40: U14.M22(IO_L15N_T2_DQS_ADV_B_15)
FPGA_LINK_BUS_IO41: U14.L20(IO_L14N_T2_SRCC_15)
FPGA_LINK_BUS_IO42: U14.K21(IO_L9P_T1_DQS_AD3P_15)
FPGA_LINK_BUS_IO43: U14.J19(IO_L12P_T1_MRCC_15)
FPGA_LINK_BUS_IO44: U14.J21(IO_L11N_T1_SRCC_15)
FPGA_LINK_BUS_IO45: U14.J17(IO_L21N_T3_DQS_A18_15)
FPGA_LINK_BUS_IO46: U14.G20(IO_L8N_T1_AD10N_15)
FPGA_LINK_BUS_IO47: U14.H18(IO_L6N_T0_VREF_15)
FPGA_LINK_BUS_IO48: U14.H17(IO_L6P_T0_15)
FPGA_LINK_BUS_IO49: U14.G13(IO_L1N_T0_AD0N_15)
FPGA_LINK_BUS_IO50: U14.F13(IO_L1P_T0_16)
FPGA_LINK_BUS_IO51: U14.E13(IO_L4P_T0_16)
FPGA_LINK_BUS_IO52: U14.E14(IO_L4N_T0_16)
FPGA_LINK_BUS_IO53: U14.F18(IO_L15P_T2_DQS_16)
FPGA_LINK_BUS_IO54: U14.E16(IO_L5P_T0_16)
FPGA_LINK_BUS_IO55: U14.F15(IO_0_16)
FPGA_LINK_BUS_IO56: U14.F14(IO_L1N_T0_16)
FPGA_LINK_BUS_IO57: U14.F16(IO_L2P_T0_16)
FPGA_LINK_BUS_IO58: U14.E17(IO_L2N_T0_16)
FPGA_LINK_BUS_IO59: U14.E18(IO_L15N_T2_DQS_16)
FPGA_LINK_BUS_IO60: U14.G21(IO_L24P_T3_16)
FPGA_LINK_BUS_IO61: U14.F20(IO_L18N_T2_16)
FPGA_LINK_BUS_IO62: U14.D19(IO_L14N_T2_SRCC_16)
FPGA_LINK_BUS_IO63: U14.E21(IO_L23P_T3_16)
FPGA_LINK_BUS_IO64: U14.F21(IO_25_16)
FPGA_LINK_BUS_IO65: U14.G22(IO_L24N_T3_16)
FPGA_LINK_BUS_IO66: U14.F19(IO_L18P_T2_16)
FPGA_LINK_BUS_IO67: U14.E19(IO_L14P_T2_SRCC_16)
FPGA_LINK_BUS_IO68: U14.E22(IO_L22P_T3_16)
FPGA_LINK_BUS_IO69: U14.D22(IO_L22N_T3_16)
FPGA_LINK_BUS_IO70: U14.C22(IO_L20P_T3_16)
FPGA_LINK_BUS_IO71: U14.B22(IO_L20N_T3_16)
FPGA_LINK_BUS_IO72: U14.C19(IO_L13N_T2_MRCC_16)
FPGA_LINK_BUS_IO73: U14.B20(IO_L16P_T2_16)
FPGA_LINK_BUS_IO74: U14.C20(IO_L19N_T3_VREF_16)
FPGA_LINK_BUS_IO75: U14.D20(IO_L19P_T3_16)
FPGA_LINK_BUS_IO76: U14.D21(IO_L23N_T3_16)
FPGA_LINK_BUS_IO77: U14.B21(IO_L21P_T3_DQS_16)
FPGA_LINK_BUS_IO78: U14.A21(IO_L21N_T3_DQS_16)
FPGA_LINK_BUS_IO79: U14.A20(IO_L16N_T2_16)
FPGA_LINK_BUS_IO80: U14.A19(IO_L17N_T2_16)
FPGA_LINK_BUS_IO81: U14.A18(IO_L17P_T2_16)
FPGA_LINK_BUS_IO82: U14.B16(IO_L7N_T1_16)
FPGA_LINK_BUS_IO83: U14.D17(IO_L12P_T1_MRCC_16)
FPGA_LINK_BUS_IO84: U14.C17(IO_L12N_T1_MRCC_16)
FPGA_LINK_BUS_IO85: U14.B18(IO_L11N_T1_SRCC_16)
FPGA_LINK_BUS_IO86: U14.C18(IO_L13P_T2_MRCC_16)
FPGA_LINK_BUS_IO87: U14.B17(IO_L11P_T1_SRCC_16)
FPGA_LINK_BUS_IO88: U14.A16(IO_L9N_T1_DQS_16)
FPGA_LINK_BUS_IO89: U14.A15(IO_L9P_T1_DQS_16)
FPGA_LINK_BUS_IO90: U14.A14(IO_L10N_T1_16)
FPGA_LINK_BUS_IO91: U14.A13(IO_L10P_T1_16)
FPGA_LINK_BUS_IO92: U14.C13(IO_L8P_T1_16)
FPGA_LINK_BUS_IO93: U14.C15(IO_L3N_T0_DQS_16)
FPGA_LINK_BUS_IO94: U14.B15(IO_L7P_T1_16)
FPGA_LINK_BUS_IO95: U14.D16(IO_L5N_T0_16)
FPGA_LINK_BUS_IO96: U14.B13(IO_L8N_T1_16)
FPGA_LINK_BUS_IO97: U14.C14(IO_L3P_T0_DQS_16)
FPGA_LINK_BUS_IO98: U14.D15(IO_L6N_T0_VREF_16)
FPGA_LINK_BUS_IO99: U14.D14(IO_L6P_T0_16)
HYPERRAM_FPGA0_CLK_N: U14.G4(IO_L12N_T1_MRCC_35) ; port HYPERRAM_FPGA0_CLK_N
HYPERRAM_FPGA0_CLK_P: U14.H4(IO_L12P_T1_MRCC_35) ; port HYPERRAM_FPGA0_CLK_P
HYPERRAM_FPGA0_CS: U14.B1(IO_L1P_T0_AD4P_35) ; port HYPERRAM_FPGA0_CS
HYPERRAM_FPGA0_DQ0: U14.E1(IO_L3P_T0_DQS_AD5P_35)
HYPERRAM_FPGA0_DQ1: U14.F3(IO_L6P_T0_35)
HYPERRAM_FPGA0_DQ2: U14.E3(IO_L6N_T0_VREF_35)
HYPERRAM_FPGA0_DQ3: U14.D1(IO_L3N_T0_DQS_AD5N_35)
HYPERRAM_FPGA0_DQ4: U14.D2(IO_L4N_T0_35)
HYPERRAM_FPGA0_DQ5: U14.E2(IO_L4P_T0_35)
HYPERRAM_FPGA0_DQ6: U14.F1(IO_L5N_T0_AD13N_35)
HYPERRAM_FPGA0_DQ7: U14.G1(IO_L5P_T0_AD13P_35)
HYPERRAM_FPGA0_RST: U14.A1(IO_L1N_T0_AD4N_35) ; port HYPERRAM_FPGA0_RST
HYPERRAM_FPGA0_RWDS: U14.C2(IO_L2P_T0_AD12P_35) ; port HYPERRAM_FPGA0_RWDS
INITB_F0: DS3.1(A) Q3.3(DRAIN)
JTAG_TCK_FPGA0: U14.V12(TCK_0) ; port JTAG_TCK_FPGA0
JTAG_TDI_FPGA0: U14.R13(TDI_0) ; port JTAG_TDI_FPGA0
JTAG_TDO_FPGA0: U14.U13(TDO_0) ; port JTAG_TDO_FPGA0
JTAG_TMS_FPGA0: U14.T13(TMS_0) ; port JTAG_TMS_FPGA0
MCU_FPGA0_IO0: U14.U20(IO_L11P_T1_SRCC_14)
MCU_FPGA0_IO1: U14.V20(IO_L11N_T1_SRCC_14)
MCU_FPGA0_IO2: U14.W22(IO_L7N_T1_D10_14)
MCU_FPGA0_IO3: U14.Y22(IO_L9N_T1_DQS_D13_14)
MCU_FPGA0_IO4: U14.Y21(IO_L9P_T1_DQS_14)
MCU_FPGA0_IO5: U14.AA21(IO_L8N_T1_D12_14)
MCU_FPGA0_IO6: U14.AB22(IO_L10N_T1_D15_14)
MCU_FPGA0_IO7: U14.AB21(IO_L10P_T1_D14_14)
MCU_FPGA0_IO8: U14.AA20(IO_L8P_T1_D11_14)
PDONE_F0: DS4.2(K) Q4.3(D)
SMC_ADC_TSNS_FPGA0: U15.2(VOUT) ; port SMC_ADC_TSNS_FPGA0
SMC_IO_FPGA0_IO0: U14.T21(IO_L4P_T0_D04_14) ; port SMC_IO_FPGA0_IO0
SMC_IO_FPGA0_IO1: U14.U21(IO_L4N_T0_D05_14) ; port SMC_IO_FPGA0_IO1
SMC_SPI_FPGA0_CLK: U14.W19(IO_L12P_T1_MRCC_14) ; port SMC_SPI_FPGA0_CLK
SMC_SPI_FPGA0_CS: U14.AB20(IO_L15N_T2_DQS_DOUT_CSO_B_14) ; port SMC_SPI_FPGA0_CS
SMC_SPI_FPGA0_RX: U14.AA19(IO_L15P_T2_DQS_RDWR_B_14) ; port SMC_SPI_FPGA0_RX
SMC_SPI_FPGA0_TX: U14.V19(IO_L14N_T2_SRCC_14) ; port SMC_SPI_FPGA0_TX
UART_RX_FPGA0: U14.R21(IO_L2N_T0_D03_14) ; port UART_RX_FPGA0
UART_TX_FPGA0: U14.P21(IO_L2P_T0_D02_14) ; port UART_TX_FPGA0
USER_FPGA0_BUTTON0: U14.R17(IO_L24N_T3_A00_D16_14)
USER_FPGA0_BUTTON1: U14.U17(IO_L18P_T2_A12_D28_14)
USER_FPGA0_BUTTON2: U14.U18(IO_L18N_T2_A11_D27_14)
USER_FPGA0_BUTTON3: U14.AB18(IO_L17N_T2_A13_D29_14)
USER_IO_FPGA0_IO0: U14.V5(IO_L16N_T2_34)
USER_IO_FPGA0_IO1: U14.U6(IO_L16P_T2_34)
USER_IO_FPGA0_IO2: U14.V7(IO_L19P_T3_34)
USER_IO_FPGA0_IO3: U14.V9(IO_L21P_T3_DQS_34)
USER_IO_FPGA0_IO4: U14.V8(IO_L21N_T3_DQS_34)
USER_IO_FPGA0_IO5: U14.W9(IO_L24P_T3_34)
USER_IO_FPGA0_IO6: U14.W6(IO_L15P_T2_DQS_34)
USER_IO_FPGA0_IO7: U14.Y9(IO_L24N_T3_34)
USER_IO_FPGA0_IO8: U14.W7(IO_L19N_T3_VREF_34)
USER_IO_FPGA0_IO9: U14.Y8(IO_L23P_T3_34)
USER_IO_FPGA0_IO10: U14.Y7(IO_L23N_T3_34)
USER_IO_FPGA0_IO11: U14.AA8(IO_L22P_T3_34)
USER_IO_FPGA0_IO12: U14.AB8(IO_L22N_T3_34)
USER_IO_FPGA0_IO13: U14.Y6(IO_L18P_T2_34)
USER_IO_FPGA0_IO14: U14.AB7(IO_L20P_T3_34)
USER_IO_FPGA0_IO15: U14.AA6(IO_L18N_T2_34)
USER_IO_FPGA0_IO16: U14.AB6(IO_L20N_T3_34)
USER_IO_FPGA0_IO17: U14.W5(IO_L15N_T2_DQS_34)
USER_IO_FPGA0_IO18: U14.AB5(IO_L10N_T1_34)
USER_IO_FPGA0_IO19: U14.AA5(IO_L10P_T1_34)
USER_IO_FPGA0_IO20: U14.Y4(IO_L11P_T1_SRCC_34)
USER_IO_FPGA0_IO21: U14.AA4(IO_L11N_T1_SRCC_34)
USER_IO_FPGA0_IO22: U14.W4(IO_L12N_T1_MRCC_34)
USER_IO_FPGA0_IO23: U14.AB3(IO_L8P_T1_34)
USER_IO_FPGA0_IO24: U14.AA3(IO_L9N_T1_DQS_34)
USER_IO_FPGA0_IO25: U14.AB2(IO_L8N_T1_34)
USER_IO_FPGA0_IO26: U14.Y3(IO_L9P_T1_DQS_34)
USER_IO_FPGA0_IO27: U14.AB1(IO_L7N_T1_34)
USER_IO_FPGA0_IO28: U14.Y2(IO_L4N_T0_34)
USER_IO_FPGA0_IO29: U14.AA1(IO_L7P_T1_34)
USER_IO_FPGA0_IO30: U14.V4(IO_L12P_T1_MRCC_34)
USER_IO_FPGA0_IO31: U14.Y1(IO_L5N_T0_34)
USER_IO_FPGA0_IO32: U14.W2(IO_L4P_T0_34)
USER_IO_FPGA0_IO33: U14.W1(IO_L5P_T0_34)
USER_IO_FPGA0_IO34: U14.V3(IO_L6N_T0_VREF_34)
USER_IO_FPGA0_IO35: U14.V2(IO_L2N_T0_34)
USER_IO_FPGA0_IO36: U14.U3(IO_L6P_T0_34)
USER_IO_FPGA0_IO37: U14.U2(IO_L2P_T0_34)
USER_IO_FPGA0_IO38: U14.U1(IO_L1N_T0_34)
USER_IO_FPGA0_IO39: U14.U5(IO_L14N_T2_SRCC_34)
USER_IO_FPGA0_IO40: U14.R6(IO_L17P_T2_34)
USER_IO_FPGA0_IO41: U14.T6(IO_L17N_T2_34)
USER_IO_FPGA0_IO42: U14.T5(IO_L14P_T2_SRCC_34)
USER_IO_FPGA0_IO43: U14.R4(IO_L13P_T2_MRCC_34)
USER_IO_FPGA0_IO44: U14.R3(IO_L3P_T0_DQS_34)
USER_IO_FPGA0_IO45: U14.R2(IO_L3N_T0_DQS_34)
USER_IO_FPGA0_IO46: U14.T4(IO_L13N_T2_MRCC_34)
USER_IO_FPGA0_IO47: U14.T1(IO_L1P_T0_34)
USER_PMOD0_FPGA0_LVIO0: U14.L5(IO_L18P_T2_35)
USER_PMOD0_FPGA0_LVIO1: U14.K6(IO_L17P_T2_35)
USER_PMOD0_FPGA0_LVIO2: U14.L4(IO_L18N_T2_35)
USER_PMOD0_FPGA0_LVIO3: U14.M6(IO_L23P_T3_35)
USER_PMOD0_FPGA0_LVIO4: U14.M5(IO_L23N_T3_35)
USER_PMOD0_FPGA0_LVIO5: U14.N5(IO_L24N_T3_35)
USER_PMOD0_FPGA0_LVIO6: U14.P6(IO_L24P_T3_35)
USER_PMOD0_FPGA0_LVIO7: U14.M3(IO_L16P_T2_35)
USER_PMOD1_FPGA0_LVIO0: U14.P4(IO_L21N_T3_DQS_35)
USER_PMOD1_FPGA0_LVIO1: U14.P5(IO_L21P_T3_DQS_35)
USER_PMOD1_FPGA0_LVIO2: U14.P2(IO_L22P_T3_35)
USER_PMOD1_FPGA0_LVIO3: U14.R1(IO_L20P_T3_35)
USER_PMOD1_FPGA0_LVIO4: U14.N3(IO_L19N_T3_VREF_35)
USER_PMOD1_FPGA0_LVIO5: U14.P1(IO_L20N_T3_35)
USER_PMOD1_FPGA0_LVIO6: U14.N2(IO_L22N_T3_35)
USER_PMOD1_FPGA0_LVIO7: U14.N4(IO_L19P_T3_35)
USER_PMOD2_FPGA0_LVIO0: U14.L3(IO_L14P_T2_SRCC_35)
USER_PMOD2_FPGA0_LVIO1: U14.M2(IO_L16N_T2_35)
USER_PMOD2_FPGA0_LVIO2: U14.M1(IO_L15P_T2_DQS_35)
USER_PMOD2_FPGA0_LVIO3: U14.K3(IO_L14N_T2_SRCC_35)
USER_PMOD2_FPGA0_LVIO4: U14.L1(IO_L15N_T2_DQS_35)
USER_PMOD2_FPGA0_LVIO5: U14.K2(IO_L9P_T1_DQS_AD7P_35)
USER_PMOD2_FPGA0_LVIO6: U14.K1(IO_L7P_T1_AD6P_35)
USER_PMOD2_FPGA0_LVIO7: U14.K4(IO_L13P_T2_MRCC_35)
USER_PMOD3_FPGA0_LVIO0: U14.J2(IO_L9N_T1_DQS_AD7N_35)
USER_PMOD3_FPGA0_LVIO1: U14.J1(IO_L7N_T1_AD6N_35)
USER_PMOD3_FPGA0_LVIO2: U14.J4(IO_L13N_T2_MRCC_35)
USER_PMOD3_FPGA0_LVIO3: U14.H2(IO_L8P_T1_AD14P_35)
USER_PMOD3_FPGA0_LVIO4: U14.J5(IO_L10P_T1_AD15P_35)
USER_PMOD3_FPGA0_LVIO5: U14.G2(IO_L8N_T1_AD14N_35)
USER_PMOD3_FPGA0_LVIO6: U14.J6(IO_L17N_T2_35)
USER_PMOD3_FPGA0_LVIO7: U14.H5(IO_L10N_T1_AD15N_35)
NetC142_2: C142.2 R60.1 R61.2 SW6.3 SW6.4
NetC160_2: C160.2 R62.1 R63.2 SW7.3 SW7.4
NetDS3_2: DS3.2(K) R64.2
NetDS4_1: DS4.1(A) R65.1
NetR52_2: R52.2 U14.F8(MGTRREF_216)

Not connected (* = marked no-connect by the designer): U14 AA9(NC)* AA10(NC)* AA11(NC)* AA13(NC)* AA14(NC)* AA15(NC)* AA16(NC)* AA18(IO_L17P_T2_A14_D30_14)* AB10(NC)* AB11(NC)* AB12(NC)* AB13(NC)* AB15(NC)* AB16(NC)* AB17(NC)* B2(IO_L2N_T0_AD12N_35)* F4(IO_0_35)* G3(IO_L11N_T1_SRCC_35)* H3(IO_L11P_T1_SRCC_35)* L6(IO_25_35)* N17(IO_L21P_T3_DQS_14)* P19(IO_L5P_T0_D06_14)* P20(IO_0_14)* R14(IO_L19N_T3_A09_D25_VREF_14)* R18(IO_L20P_T3_A08_D24_14)* R19(IO_L5N_T0_D07_14)* T3(IO_0_34)* T14(NC)* T15(NC)* T16(NC)* T18(IO_L20N_T3_A07_D23_14)* T20(IO_L6N_T0_D08_VREF_14)* U7(IO_25_34)* U15(NC)* U16(NC)* V10(NC)* V13(NC)* V14(NC)* V15(NC)* V17(IO_L16P_T2_CSI_B_14)* V22(IO_L3N_T0_DQS_EMCCLK_14)* W10(NC)* W11(NC)* W12(NC)* W14(NC)* W15(NC)* W16(NC)* W17(IO_L16N_T2_A15_D31_14)* W20(IO_L12N_T1_MRCC_14)* W21(IO_L7P_T1_D09_14)* Y11(NC)* Y12(NC)* Y13(NC)* Y14(NC)* Y16(NC)* Y17(NC)* Y19(IO_L13N_T2_MRCC_14)*; U16 2(NC)*

## Buses and harness runs
bus FPGA0_LED[0..7] = port FPGA0_LED[0..7]
bus FPGA_LINK_BUS_IO[0..99] = port FPGA_LINK_BUS_IO[0..99]
bus HYPERRAM_FPGA0_DQ[0..7] = port HYPERRAM_FPGA0_DQ[0..7]
bus MCU_FPGA0_IO[0..8] = port MCU_FPGA0_IO[0..8]
bus USER_FPGA0_BUTTON[0..3] = port USER_FPGA0_BUTTON[0..3]
bus USER_IO_FPGA0_IO[0..47] = port USER_IO_FPGA0_IO[0..47]
bus USER_PMOD0_FPGA0_LVIO[0..7] = port USER_PMOD0_FPGA0_LVIO[0..7]
bus USER_PMOD1_FPGA0_LVIO[0..7] = port USER_PMOD1_FPGA0_LVIO[0..7]
bus USER_PMOD2_FPGA0_LVIO[0..7] = port USER_PMOD2_FPGA0_LVIO[0..7]
bus USER_PMOD3_FPGA0_LVIO[0..7] = port USER_PMOD3_FPGA0_LVIO[0..7]

## Layout directives
differential pair: FPGA0_ADC_IN_N, FPGA0_ADC_IN_P, FPGA0_ADC_IN_R_N, FPGA0_ADC_IN_R_P, FPGA0_ADC_VREF_N, FPGA0_ADC_VREF_P, FPGA0_CLK_N, FPGA0_CLK_P, FPGA0_GTP_CLK_C_N, FPGA0_GTP_CLK_C_P, FPGA0_GTP_CLK_N, FPGA0_GTP_CLK_P, FPGA0_RX0_N, FPGA0_RX0_P, FPGA0_RX1_N, FPGA0_RX1_P, FPGA0_RX2_N, FPGA0_RX2_P, FPGA0_RX3_N, FPGA0_RX3_P, FPGA0_TX0_N, FPGA0_TX0_P, FPGA0_TX1_N, FPGA0_TX1_P, FPGA0_TX2_N, FPGA0_TX2_P, FPGA0_TX3_N, FPGA0_TX3_P, HYPERRAM_FPGA0_CLK_N, HYPERRAM_FPGA0_CLK_P

## Notes on the sheet
- NOTE:
- Test points on FPGA1 Page will be spaced >2.54mm apart in staggered pattern
- Note:
- (near U14) Addon PCB will be developed with P70-2200045 Springloaded probes to provide access to all test points
- (near U14) User IO's Go to IO Buffers First
- FPGA SYS CLK
- FPGA GTP CLK
- FPGA DECOUPLING CAPACITORS
- (near R61) CLR Config
- (near R63) RST
- INIT Done
- SPI Flash -> 100 (M0, M1, M2)
- JTAG -> 101 (M0, M1, M2)
- M0 - M2 default to HIGH, toggle switch to pull LOW
- See UG470 for more info
- PROG Done
- FPGA ADC IN
- (near R69) DNF
- (near R70) DNF
- (in symbol CMP-007-000006-8) Title; Size; Project; Revision; Designer:; Sheet; of; Date:
- (in symbol CMP-0383-00020-1, part A) BANK 14
- (in symbol CMP-0383-00020-1, part B) BANK 15
- (in symbol CMP-0383-00020-1, part C) BANK 16
- (in symbol CMP-0383-00020-1, part D) BANK 34
- (in symbol CMP-0383-00020-1, part E) BANK 35

## Library data of the parts
* = CMP-007-000006-8: Generic Title Block
C134 C137-C141 C196 C197 C200 C342 C343 = CMP-001-00095-1: Cap Ceramic 0.1uF 50V X7R 20% SMD 0402 125°C Paper T/R GRM155R71H104ME14J; Voltage: 50V; Capacitance: 100nF; Case: 0402
C136 = CMP-2008-02634-1: 04025A300JAT2A; Manufacturer: AVX Interconnect / Elco; Part Number: 04025A300JAT2A
C142 C160 = CMP-2008-04543-1: GRM155R60J225ME15D; Manufacturer: Murata; Part Number: GRM155R60J225ME15D
C143-C148 C153-C159 C201-C207 C216-C222 = CMP-001-00098-2: 0402 0.1 uF 25 V ±10% Tolerance X7R SMT Multilayer Ceramic Capacitor; Voltage Rating: 25V; Tolerance: 10%; Dielectric: X7R; Case/Package: 0402
C149-C152 C162 C170 C173 C182 C185 C194 C208 C223 = CMP-001-00097-1: Cap 10UF 6.3VDC X5R 20% SMD 0603 Paper Tape; Voltage Rating: 6.3V; Case/Package: 0603; Tolerance: 20%
C161 C171 C172 C183 C184 C195 C209 C210 C224 C225 = CMP-001-00100-1: Cap Ceramic 220uF 6.3V X5R 20% SMD 1210 85°C Emboss T/R GRM32ER60J227ME05K
C163-C169 C174-C181 C186-C193 C198 C199 C211-C215 C226-C228 = CMP-001-00099-1: Dielectric: X5R; Tolerance: 20%; Voltage Rating: 10V; Case/Package: 0402
DS3 DS4 = CMP-007-00037-1: LED GREEN DIFFUSED SMD; Color: Green; Case/Package: 0603
J3 = CMP-2000-05415-1: SMA Connector, Pitch 5.08 mm, 1 Position, Height 9.5 mm, Tail Length 4 mm, -65 to 165 degC, RoHS, Bulk; Manufacturer: TE Connectivity; Connector Mounting: PCBMount; Connector Body Style: StraightJack; Impedance: 50ohm; Coaxial Termination: Solder; SVHC: NoSVHC(15-Jun-2015); Frequency Max: 3GHz; Product Range: ZDCSeries; Connector Type: SMACoaxial; Datasheet Version: Rev. B1, 03/2011; Package Reference: 5-1814832-1; Package Description: SMA Connector, Pitch 5.08 mm, 1 Position, Height 9.5 mm, Tail Length 4 mm; Contact Plating: GoldPlatedContacts; Coaxial Cable Types: -; Contact Material: BerylliumCopper; Manufacturer URL: http://www.te.com/; Datasheet URL: http://www.onlinecomponents.com/productFiles/mf-AMP/eng_cd_1814832_a.pdf
L6 = CMP-0220-00109-1: SMD EMI Suppression Ferrite Bead WE-CBF, Z = 600 Ohm; Impedance: 600 Ohm; ComponentLink2Description: Datasheet; ComponentLink1Description: Manufacturer Link; PackageReference: SMD-0402; PackageVersion: 2009; ComponentLink1URL: http://www.we-online.com; PackageDescription: Chip Inductor, 2-Leads, Body 1.0 x 0.5 mm; DatasheetVersion: ver 6, Jul-2009; ComponentLink2URL: http://www.we-online.de/katalog/media/pdf/74279279.pdf
Q3 = CMP-2000-05778-1: P-Channel MOSFET, 30 V, 4 A, -55 to 150 degC, 3-Pin SOT-23-3L, RoHS, Tape and Reel; Manufacturer: Alpha and Omega; Output Power (Max): NotRequiredW; Power Dissipation: 1.4W; Rad Hardened: No; Drain Efficiency: NotRequired%; Drain-Source On-Volt: 30V; Noise Figure: NotRequireddB; Frequency (Max): NotRequiredMHz; Number of  Elements: 1; Gate-Source Voltage (Max): ?12V; Drain Current (Max): 4A; Channel Mode: Enhancement; Drain-Source On-Res: 0.044ohm; Type: PowerMOSFET; Polarity: P; Package URL: http://www.aosmd.com/res/packaging_information/SOT-23-3L.pdf; Datasheet URL: http://www.aosmd.com/res/data_sheets/AO3401A.pdf; Package Type: SOT-23; Package Description: 3-Pin Small Outline Transistor, Body 2.95 x 1.6 mm, Pitch 0.95 mm; Mounting: SurfaceMount; Manufacturer URL: http://www.aosmd.com/; Continuous Drain Current: 4A; Package Reference: SOT-23-3L; Mounting Technology: SurfaceMount; Operating Temperature Classification: Military; Power Gain: NotRequireddB; Datasheet Version: Rev. 3, 03/2011; Operating Temp Range: -55Cto150C; Pin Count: 3
Q4 = CMP-2000-04929-2: MOSFET N-CH 60V 115MA SOT23-3; Turn-On Delay Time: 7ns; Turn-Off Delay Time: 11ns; Drain to Source Resistance: 7.5R; Rise Time: 3ns; Drain to Source Breakdown Voltage: 70V; Input Capacitance: 50pF; Number of Elements: 1; Power Dissipation: 540mW; Max Power Dissipation: 300mW; Fall Time: 5.6ns; Gate to Source Voltage (Vgs): 20V; Threshold Voltage: 2.5V; Element Configuration: Single; Termination: SMD/SMT; Weight: 0.000282oz; Radiation Hardening: No; Max Operating Temperature: 150°C; On-State Resistance: 7.5R; Mount: Surface Mount; Current Rating: 115mA; Contact Plating: Tin; Lead Free: Lead Free; Min Operating Temperature: -55°C; Number of Pins: 3; REACH SVHC: No SVHC; Drain to Source Voltage (Vdss): 60V; Width: 1.3mm; Package Quantity: 3000; Length: 2.9mm; Case/Package: SOT-23; Number of Channels: 1; Dual Supply Voltage: 60V; Packaging: Tape and Reel; Height: 1mm; Voltage Rating (DC): 60V; Nominal Vgs: 2.5V; Continuous Drain Current (ID): 115mA; Voltage: 60V; Rds On Max: 7.5R
R52 = CMP-2002-00605-3: Chip Resistor, 100 Ohm, +/- 1%, 100 mW, -55 to 155 degC, 0402 (1005 Metric), RoHS, Tape and Reel ERJ-2RKF1000X; Manufacturer: Basic Passives; Power Rating: 100 mW; Resistance: 100 Ohm; Voltage Rating: 50 V; Case\/Package: 0402; Width: 0.5 mm; Pins: 2; ComponentLink2Description: Datasheet; PackageReference: 0402; Height: 0.35 mm; Tolerance: 1%; DatasheetVersion: 04/2015; Case Code (Imperial): 0402; Min Operating Temperature: -55 degC; Radiation Hardening: No; Length: 1 mm; Package Quantity: 10000; PackageDescription: 2-Pin Surface Mount Device, Body 1 x 0.5 mm; Mounting Technology: Surface Mount; Case Code (Metric): 1005; Packaging: Tape and Reel; ComponentLink1URL: http://www.panasonic.com/; RoHSCompliant: true; Max Operating Temperature: 155 degC; REACH SVHC: Yes; PartNumber: ERJ-2RKF1000X; ComponentLink1Description: Manufacturer URL; ComponentLink2URL: http://industrial.panasonic.com/cdbs/www-data/pdf/RDA0000/AOA0000C86.pdf; Mount: Surface Mount
R54-R59 R61 R63-R65 = CMP-2002-03045-1: CRCW04021K00FKEDHP; Manufacturer: Vishay Dale; Part Number: CRCW04021K00FKEDHP
R60 R62 = CMP-2002-03055-1: CRCW04023K30FKEDHP; Manufacturer: Vishay Dale; Part Number: CRCW04023K30FKEDHP
R66 = CMP-2002-08459-1: CRCW04022K40FKED; Manufacturer: Vishay Dale; Part Number: CRCW04022K40FKED
R68-R71 = CMP-2002-03041-1: CRCW04020000Z0EDHP; Manufacturer: Vishay Dale; Part Number: CRCW04020000Z0EDHP
SW6 SW7 = CMP-08834-000008-1: SWITCH TACTILE SPST-NO 0.05A 24V; Throw Configuration: SPST; Switch Function: Off-Mom; Switch Travel: 0.25mm; Contact Current Rating: 50mA; Actuator Length: 0.8mm; Mechanical Life: 500000Cycles; Contact Resistance: 100mR; Operating Force: 1.57N; Actuator Type: Standard; Illumination Type: Non-Illuminated; Ratings: IP67; Number of Poles: 1; Package Quantity: 1; Orientation: Straight; REACH SVHC: No SVHC; Lead Free: Lead Free; Max Current Rating: 50mA; Contact Plating: Silver; Current Rating: 50mA; Depth: 9mm; Contact Material: Bronze; Electrical Life: 500000Cycles; Termination: Gull Wing; Width: 6mm; Packaging: Tape and Reel; Min Operating Temperature: -25°C; Radiation Hardening: No; Max Voltage Rating (DC): 24V; Max Operating Temperature: 70°C; Length: 6.6mm; Height: 3.65mm; Voltage Rating (DC): 24V; Weight: 0.010582oz; Mount: Surface Mount
SW8 = CMP-08827-000069-1: SWITCH SLIDE DIP SPST 25MA 24V; Number of Positions: 3; Actuator Length: 0mm; Actuator Type: Slide (Standard); Electrical Life: 1000Cycles; Pitch: 0.1inch; Washable: No; Contact Resistance: 200mR; Max Operating Temperature: 70°C; Min Operating Temperature: -20°C; RoHS Compliant: Yes; Case/Package: DIP; Voltage Rating (DC): 24V; Number of Circuits: 3; Orientation: Straight; Contact Material: Gold; Series: A6S-H; Terminal Pitch: 2.54mm; Contact Current Rating: 25mA; Mount: Surface Mount; Packaging: Rail/Tube; Contact Plating: Gold; Max Current Rating: 25mA; Package Quantity: 55; Length: 0.337inch; Current Rating: 25mA; REACH SVHC: No SVHC; Max Voltage Rating (DC): 24V; Mechanical Life: 1000Cycles; Throw Configuration: SPST; Termination: Gull Wing
U14 = CMP-0383-00020-1: Artix-7 FPGA, 250 User I/Os, 4 GTP, 484-Ball BGA, Speed Grade 1, Commercial Grade, Pb-Free; Manufacturer: Xilinx; GTP: 4; Total Block RAM: 1800 Kb; CMTs: 5; Logic Cells: 33280; Available User I/O: 250; Speed Grades: 1; Mounting Technology: Surface Mount; ComponentLink4URL: http://www.xilinx.com/support/documentation/user_guides/ug475_7Series_Pkg_Pinout.pdf; PackageVersion: Rev. 1.11; ComponentLink3URL: http://www.xilinx.com/support/documentation/user_guides/ug475_7Series_Pkg_Pinout.pdf; PartNumber: XC7A35T-1FGG484C; ComponentLink1Description: Manufacturer URL; ComponentLink2URL: http://www.xilinx.com/support/documentation/data_sheets/ds180_7Series_Overview.pdf; DatasheetVersion: Rev. 1.15; ComponentLink1URL: http://www.xilinx.com/; ComponentLink4Description: Package Specification; ComponentLink2Description: Datasheet; Maximum Distributed RAM: 400 Kb; PackageReference: FGG484; PackageDescription: 484-Ball Wire-Bond Fine-Pitch BGA, Body 23 x 23 mm, Pitch 1 mm; Operating Temperature Range: Commercial; ComponentLink3Description: Pinout
U15 = CMP-0192-00223-1: Precision Temperature-to-Voltage Converter, 3-Pin SOT-23, Extended Temperature, Tape and Reel; PackageVersion: revBB, Aug-2009; Code_IPC: SOT23-3; PackageDescription: 3-Lead Plastic Small Outline Transistor (NB) [SOT-23]; DatasheetVersion: revC, May-2005; PackageReference: SOT-23-NB3
U16 = CMP-023-00001-1: Xtal Osc Xo 135.0000MHZ Lvds SMD; Frequency: 135Mhz; Output: LVDS
U17 = CMP-0367-00158-2: 1.25 V, 50 ppm / degC, 50 uA Series (Bandgap) Voltage Reference, -40 to 125 degC, 3-pin SOT-23 (DBZ), Green (RoHS & no Sb/Br); Manufacturer: Texas Instruments; Iq(Max)(uA): 50; Initial Accuracy @ 25/deg C(%): 0.2; Rating: Catalog; VI(Max)(V): 5.5; VI(Min)(V): 1.8; Temp Coeff(Typ)(ppm/ degree C): 20; SubFamily: Series Voltage Reference; VO(V): 1.25; ComponentLink1Description: Manufacturer URL; ComponentLink1URL: http://www.ti.com/; PartNumber: REF3012AIDBZT; PackageDescription: 3-Pin Plastic Small Outline, Body 2.92 x 1.3 mm, Pitch 0.95 mm; Mounting Technology: Surface Mount; Eco-Plan: Green (RoHS & no Sb/Br); PackageVersion: 4203227/B; ComponentLink2URL: http://www.ti.com/general/docs/lit/getliterature.tsp?genericPartNumber=REF3012&fileType=pdf; ComponentLink2Description: Datasheet; Temp Coeff(Max)(ppm/ degree C): 50; Code_JEDEC: TO-236; PackageReference: DBZ0003A; ComponentLink3Description: Package Specification; DatasheetVersion: SBVS032F; ComponentLink3URL: http://www.ti.com/litv/pdf/mpds108a
U18 = CMP-019-00065-2: Flash, Multi I/O SPI, QPI, DTR, 2.3-3.6V, -40 to 125°C, 8-pin SOIC 208mil, RoHS; Frequency: 133MHz; Memory Format: Non-Volatile,FLASH; Memory Size: 128Mb; Case/Package: SOIC
X2 = CMP-003-00032-1: Single Ended CMOS Oscillator 3.3V 100Mhz